# Altium schematic sheet Precharge.SCHDOC
size A4; Organization: UNSW Solar Racing Team; Address3: UNSW; Address4: Sydney NSW 2052; Address2: Electrical Engineering; Address1: Rm 109
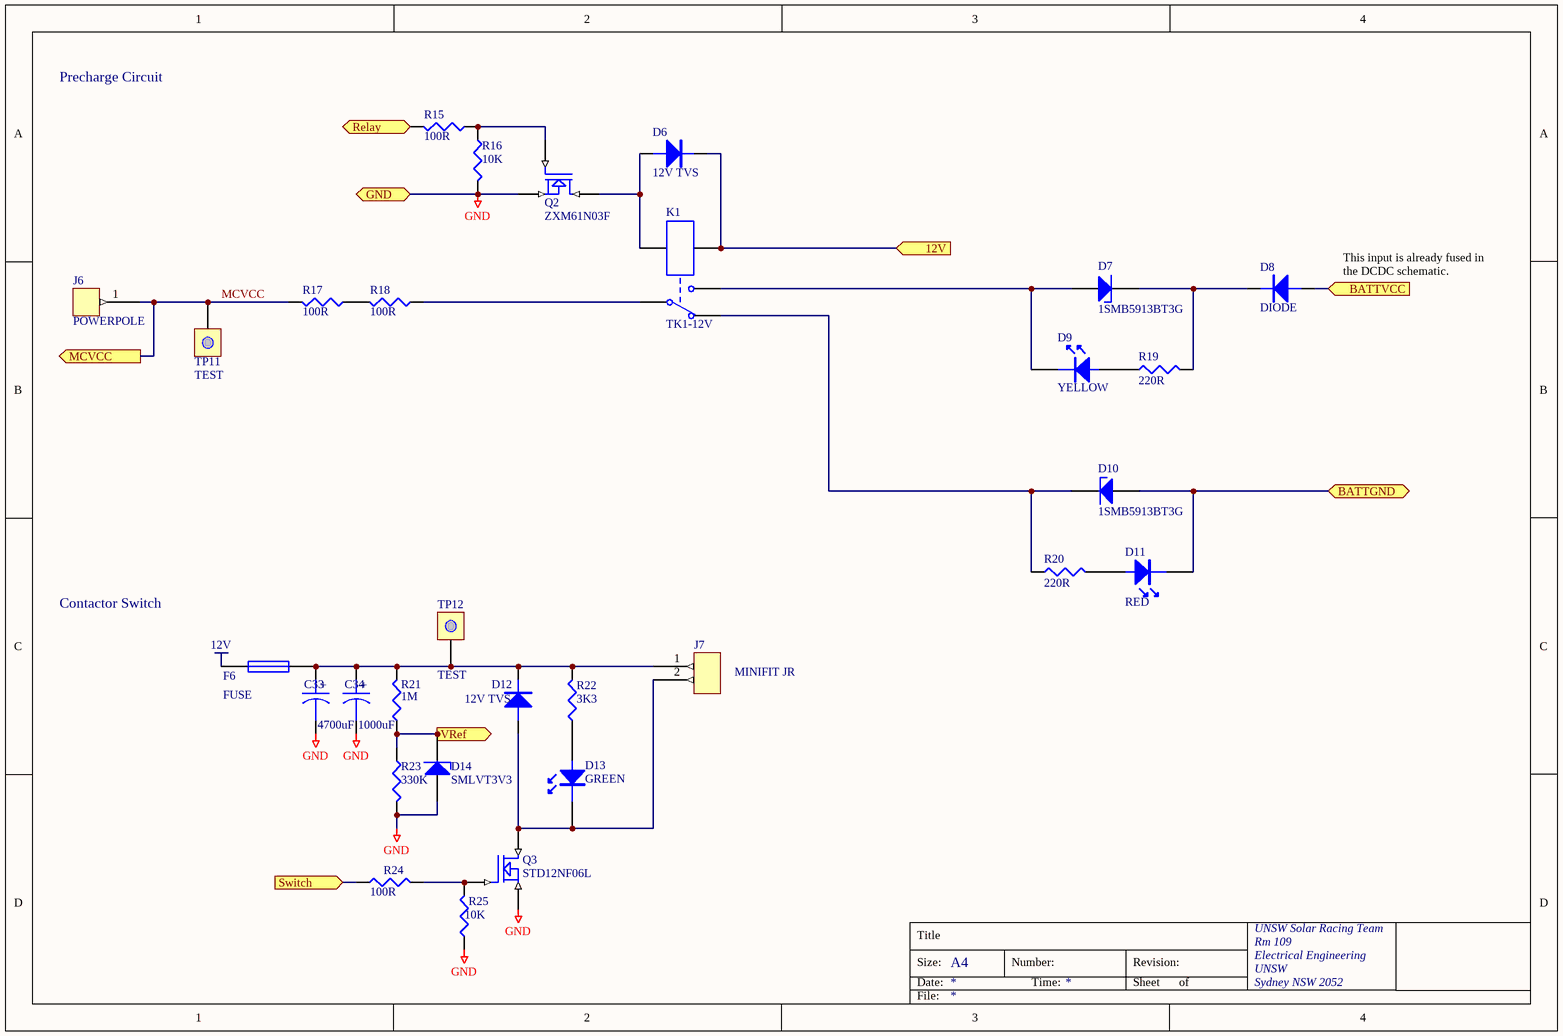
[diagram p0: Precharge.SCHDOC]

## Parts
C33  4700uF  [ELECTROLYTIC-10-20]
C34  1000uF  [ELECTROLYTIC-5-10]
D6  12V TVS  [SMA]
D7  1SMB5913BT3G  [SMB]
D8  DIODE  [DIODE-D1.2mm]
D9  YELLOW  [LED-RA]
D10  1SMB5913BT3G  [SMB]
D11  RED  [LED-RA]
D12  12V TVS  [SMA]
D13  GREEN  [LED-RA]
D14  SMLVT3V3  [SMB]
F6  FUSE  [LITTELFUSE-154]
J6  POWERPOLE  [POWERPOLE25A]
J7  MINIFIT JR  [MINIFITJR-2]
K1  TK1-12V  [TK1-12V]
Q2  ZXM61N03F  [SOT23-3]
Q3  STD12NF06L  [DPAK_N-MOSFET]
R15  100R  [0603]
R16  10K  [0603]
R17  100R  [LTO100]
R18  100R  [LTO100]
R19  220R  [0805]
R20  220R  [0805]
R21  1M  [0603]
R22  3K3  [0603]
R23  330K  [0603]
R24  100R  [0603]
R25  10K  [0603]
TP11  TEST  [TESTPOINT]
TP12  TEST  [TESTPOINT]

## Ports
12V (in), BATTGND (bidir), BATTVCC (in), GND (bidir), MCVCC (out), Relay (in), Switch (in), VRef (out)

## Nets
12V: F6.1
GND: C33.2 C34.2 D14.A Q2.2(S) Q3.3(S) R16.2 R23.2 R25.1 ; port GND
12V: D6.K K1.1 ; port 12V  [a separate net that carries the same name]
BATTGND: D10.A D11.K ; port BATTGND
BATTVCC: D8.A ; port BATTVCC
MCVCC: J6.1 R17.2 TP11.0(TP) ; port MCVCC
Relay: R15.2 ; port Relay
Switch: R24.1 ; port Switch
VRef: D14.K R21.1 R23.1 ; port VRef
NetC33_1: C33.1 C34.1 D12.K F6.2 J7.1 R21.2 R22.2 TP12.0(TP)
NetD6_A: D6.A K1.3 Q2.3(D)
NetD7_A: D7.A D9.K K1.6
NetD7_K: D7.K D8.K R19.2
NetD9_A: D9.A R19.1
NetD10_K: D10.K K1.4 R20.1
NetD11_A: D11.A R20.2
NetD12_A: D12.A D13.K J7.2 Q3.2(D)
NetD13_A: D13.A R22.1
NetK1_5: K1.5 R18.1
NetQ2_1: Q2.1(G) R15.1 R16.1
NetQ3_1: Q3.1(G) R24.2 R25.2
NetR17_1: R17.1 R18.2

## Notes on the sheet
- Precharge Circuit
- (near D8) This input is already fused in the DCDC schematic.
- Contactor Switch
- Title
- Size:
- Date:
- A4
- Number:
- Time:
- Revision:
- Sheet
- of
- File:
- (in symbol CAPACITOR POL) +

## Library data of the parts
C33 C34 = CAPACITOR POL: Capacitor
  C33: Digikey: 493-1089-ND; DigikeyPrice: 1.51
  C34: Price: 1.36; Farnell: 9451226
D6 D12 = DIODE: Farnell: 9802754; FarnellPrice: 1.20; Digikey: 497-6503-1-ND; DigikeyPrice: 0.56
D7 D10 = ZENER1: Zener Diode; Order#: 1431155; Supplier: Farnell; Price: 0.35
D9 D11 D13 = LED: Price: 0.81
  D9: Farnell: 1003378
  D11: Farnell: 1003377
  D13: Farnell: 1003381
D14 = ZENER1: TVS; Farnell: 9802886; Price: 1.10; Digikey: 497-2496-1-ND; DigikeyPrice: 0.72
J6 = CON1: RS: 459-222 + 534-963; Farnell: -; Digikey: -
J7 = CON2: Farnell: 1012166; FarnellPrice: 1.22; Digikey: WM3900-ND; DigikeyPrice: 0.99
K1 = TK1-12V: SPCO 12V 2A Relay; Farnell: 1380961; FarnellPrice: 7.07; Digikey: 255-1029-5-ND; DigikeyPrice: 4.7
Q2 = ZXM61N02F: 1.7A, 20V N-Channel Enhancement mode FET; Farnell: 9525289; Price: 0.73; Digikey: ZXM61N03FCT-ND; DigikeyPrice: 0.72
Q3 = STD12NF06L: N-type MOSFET; Farnell: 9946373
R15 R21-R24 = RES1
  R15: Farnell: 911-112; Price: 0.119
  R21: Farnell: 9330410; Price: 0.06
  R22: Farnell: 1632396; Price: 0.06
  R23: Farnell: 9330836; Price: 0.06
  R24: Farnell: 9330364; Price: 0.06
R16-R18 R25 = RES1: Resistor
  R16 R25: Farnell: 9330399; Price: 0.06
  R17 R18: Farnell: 9567330; Digikey: LT100J-100-ND; DigikeyPrice: 8.09; FarnellPrice: 22.4
R19 R20 = RES1: Resistor; Order#: 1469899; Supplier: Farnell; Price: 0.1
TP11 TP12 = TEST: TEST POINT
D8 = DIODE: Farnell: 9556133; FarnellPrice: 0.18
F6 = FUSE: Farnell: 9943609; Price: 7.78; Digikey: -